# EAGLE schematic encoder (EAGLE 6.4)
PyRadio
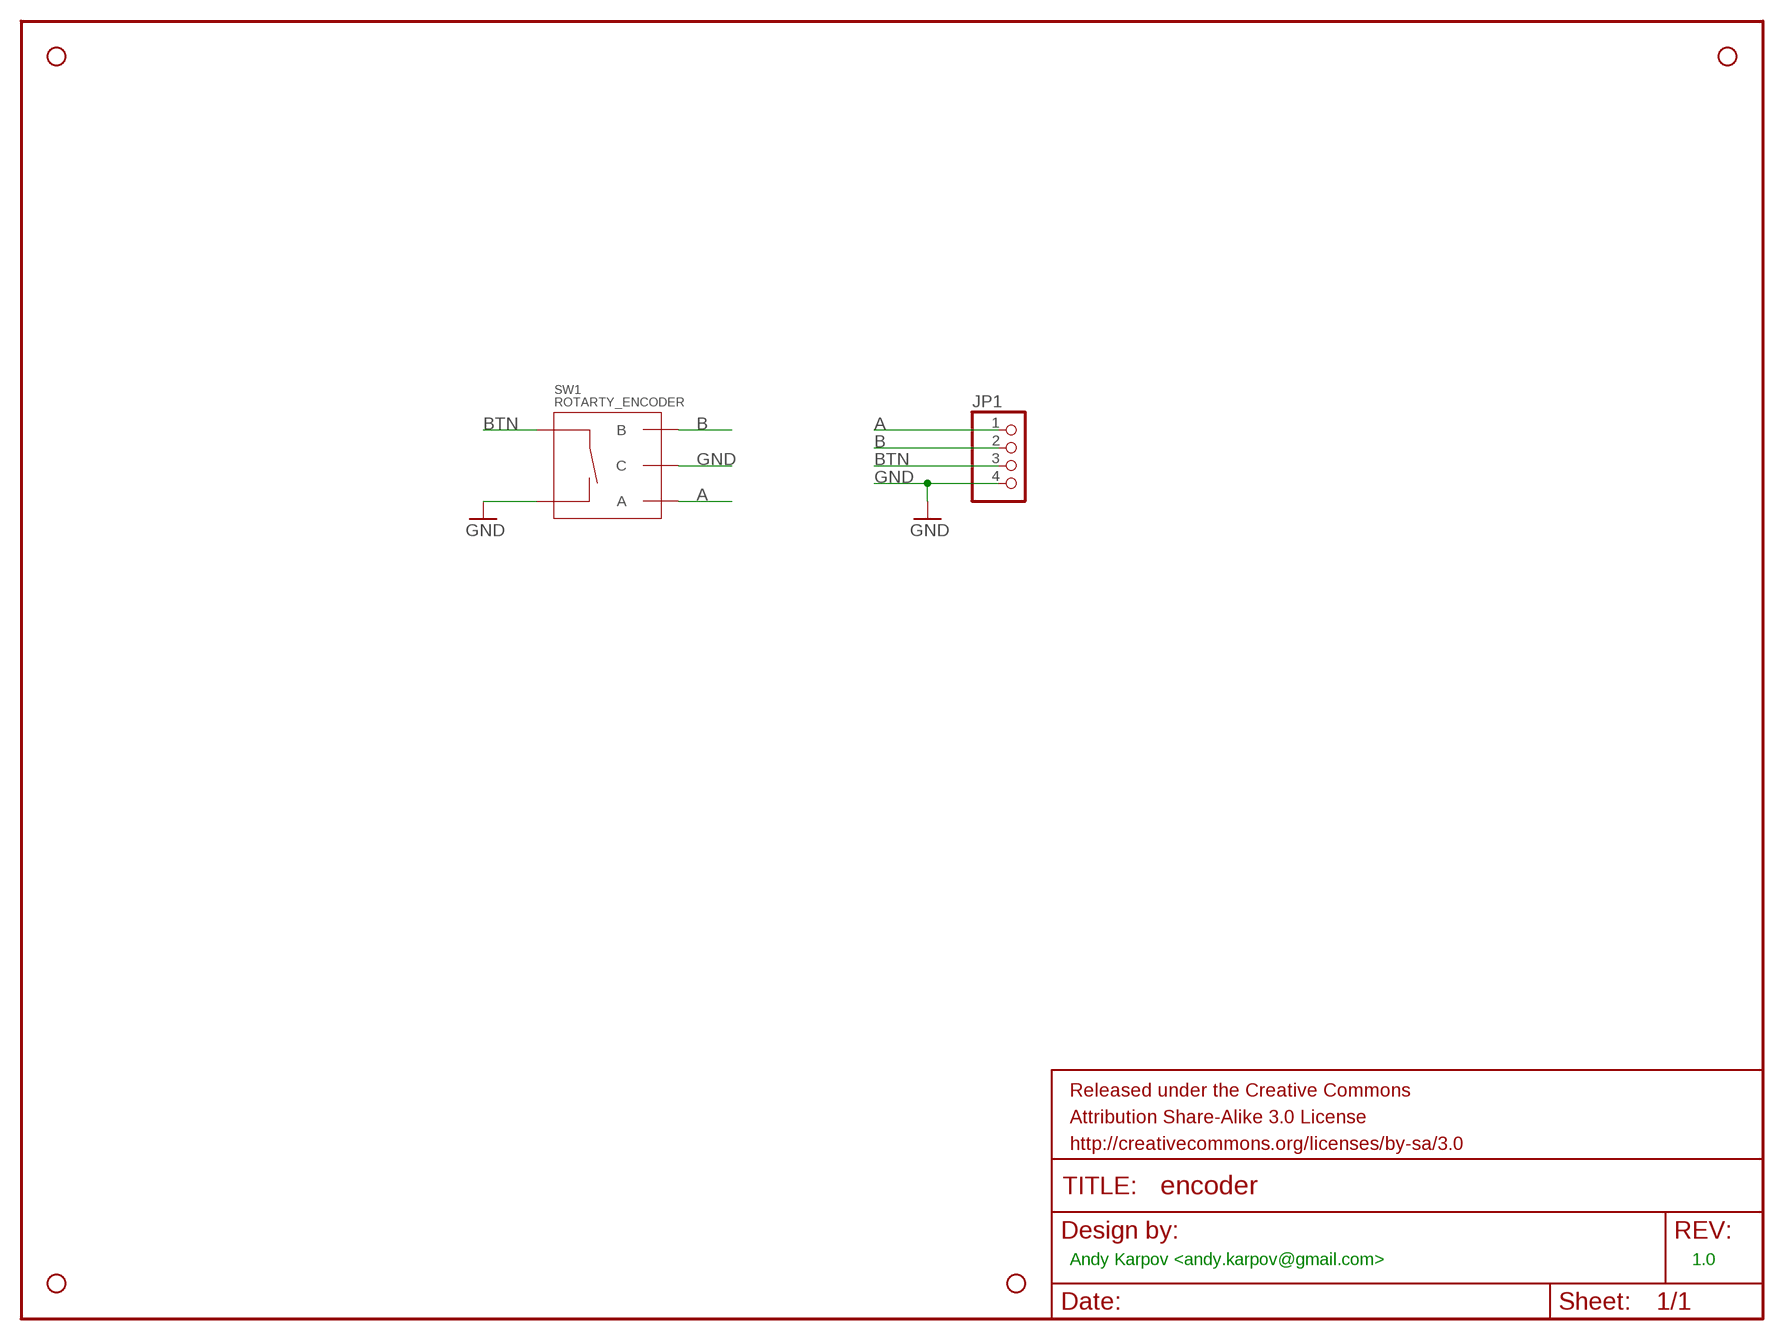
[diagram p0: schematic, sheet 1]

## Parts
FRAME1  FRAME-LETTER  [CREATIVE_COMMONS]
JP1  PINHD-1X4  [1X04]
STANDOFF1  STAND-OFF  [STAND-OFF]
STANDOFF2  STAND-OFF  [STAND-OFF]
STANDOFF3  STAND-OFF  [STAND-OFF]
STANDOFF4  STAND-OFF  [STAND-OFF]
SW1  ROTARTY_ENCODER  [ROTARY_ENC_PLAIN]

## Nets
A: JP1.1 SW1.A
B: JP1.2 SW1.B
BTN: JP1.3 SW1.SW+
GND: JP1.4 SW1.C SW1.SW-

## Notes on the sheet
- Andy Karpov <andy.karpov@gmail.com> | 1.0

## Library data of the parts
FRAME1 = SparkFun-Aesthetics:FRAME-LETTER: Schematic Frame Standard 8.5x11 US Letter frame
JP1 = pinhead:PINHD-1X4: PIN HEADER
STANDOFF1-STANDOFF4 = SparkFun-Electromechanical:STAND-OFF: #4 Stand Off This is the mechanical footprint for a #4 phillips button head screw. Use the keepout ring to avoid running the screw head into surrounding components. SKU : PRT-00447
SW1 = SparkFun-Electromechanical:ROTARTY_ENCODER: Simple no LED rotary encoder Example: COM-09117